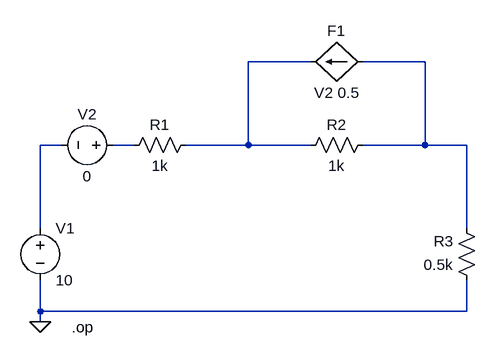
[diagram p0: schematic CH03-KP4-01.asc]
CH03-KP4-01.asc, the LTspice schematic file:
Version 4
SHEET 1 880 680
WIRE 320 144 224 144
WIRE 496 144 400 144
WIRE -64 272 -96 272
WIRE 48 272 16 272
WIRE 224 272 224 144
WIRE 224 272 128 272
WIRE 320 272 224 272
WIRE 496 272 496 144
WIRE 496 272 400 272
WIRE 560 272 496 272
WIRE -96 400 -96 272
WIRE 560 400 560 272
WIRE -96 528 -96 480
WIRE 560 528 560 480
WIRE 560 528 -96 528
WIRE -96 544 -96 528
FLAG -96 544 0
DATAFLAG 560 368 "$"
SYMBOL res 144 256 R90
WINDOW 0 0 56 VBottom 2
WINDOW 3 32 56 VTop 2
SYMATTR InstName R1
SYMATTR Value 1k
SYMBOL res 416 256 R90
WINDOW 0 0 56 VBottom 2
WINDOW 3 32 56 VTop 2
SYMATTR InstName R2
SYMATTR Value 1k
SYMBOL res 576 496 R180
WINDOW 0 36 76 Left 2
WINDOW 3 36 40 Left 2
SYMATTR InstName R3
SYMATTR Value 0.5k
SYMBOL voltage -96 384 R0
SYMATTR InstName V1
SYMATTR Value 10
SYMBOL voltage 32 272 R90
WINDOW 0 -32 56 VBottom 2
WINDOW 3 32 56 VTop 2
SYMATTR InstName V2
SYMATTR Value 0
SYMBOL f 400 144 R90
WINDOW 0 -32 40 VBottom 2
WINDOW 3 32 40 VTop 2
SYMATTR InstName F1
SYMATTR Value V2 0.5
TEXT -48 552 Left 2 !.op

The netlist it stands for:
* CH03-KP4-01.asc
R1 N001 N004 1k
R2 N002 N001 1k
R3 0 N002 0.5k
V1 N003 0 10
V2 N004 N003 0
F1 N002 N001 V2 0.5
.op
.backanno
.end